# Altium schematic sheet GPS.SchDoc: Smart Bus Ticketing Machine/GPS
size A4; Date: 3/10/2025; ApprovedBy: Kiran Gunathilaka; CheckedBy: Kiran Gunathilaka; Author: Kiran Gunathilaka; DrawnBy: Kiran Gunathilaka; DocumentNumber: 04; Revision: v1.1; SheetNumber: 3; SheetTotal: 11
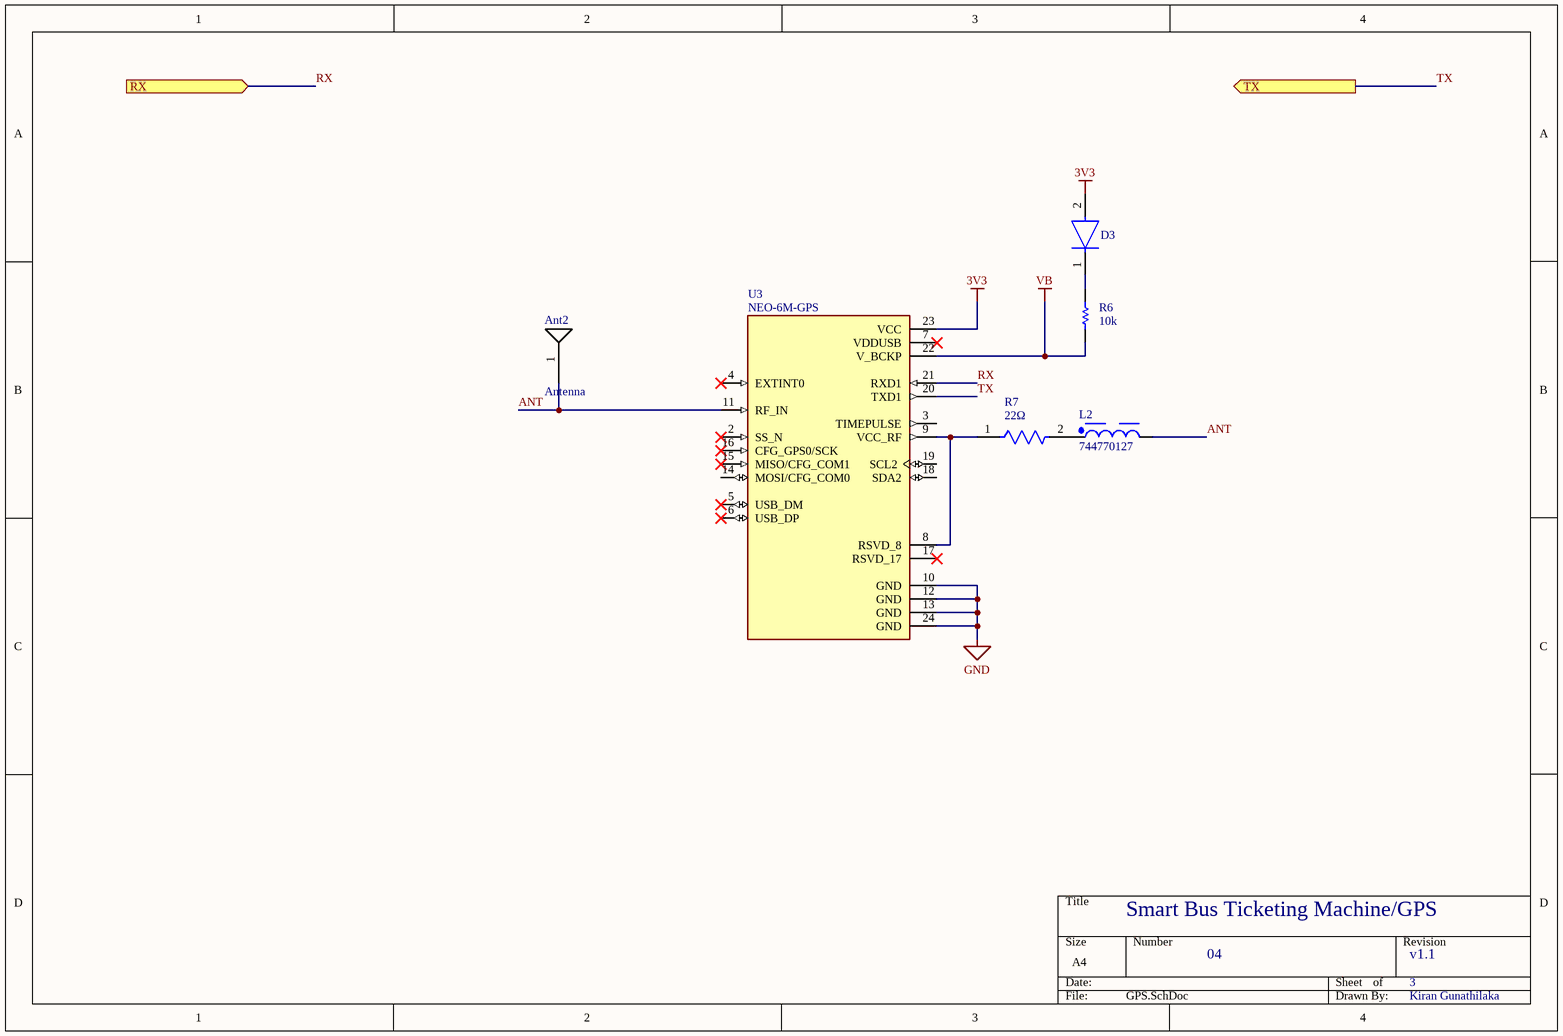
[diagram p0: GPS.SchDoc]

## Parts
Ant2  Antenna  [Antenna]
D3  TS4148 RYG  [FP-TS4148_RYG-MFG]  (value not drawn)
L2  744770127  [WE-PD_1280]
R6  value 10k  [RESC2013X60X35NL10T20]  (hidden comment: RC0805FR-0710KL)
R7  value 22Ω  [FP-CRGCQ0805-IPC_C]  (hidden comment: CRGCQ0805F22R)
U3  NEO-6M-GPS  [XCVR_NEO-6M-GPS]

## Ports
RX (in, see Main[2B]), TX (out, see Main[2B])

## Nets
3V3: D3.2(A) U3.23(VCC)
GND: U3.10(GND) U3.12(GND) U3.13(GND) U3.24(GND)
VB: R6.1 U3.22(V_BCKP)
ANT: Ant2.1 L2.2 U3.11(RF_IN)
RX: U3.21(RXD1) ; port RX
TX: U3.20(TXD1) ; port TX
NetD3_1: D3.1(C) R6.2
NetL2_1: L2.1 R7.2
NetR7_1: R7.1 U3.8(RSVD_8) U3.9(VCC_RF)

Not connected (* = marked no-connect by the designer): U3 2(SS_N)* 3(TIMEPULSE) 4(EXTINT0)* 5(USB_DM)* 6(USB_DP)* 7(VDDUSB)* 14(MOSI/CFG_COM0) 15(MISO/CFG_COM1)* 16(CFG_GPS0/SCK)* 17(RSVD_17)* 18(SDA2) 19(SCL2)

## Library data of the parts
D3 = CMP-15605-000006-1: Rectifier Diode Switching 75V 0.15A 4ns 2-Pin Case 0805(2012Metric) T/R; Peak Non-Repetitive Surge Current: 2A; Element Configuration: Single; Forward Voltage: 1V; Max Operating Temperature: 175°C; Packaging: Tape and Reel; Radiation Hardening: No; Min Operating Temperature: -65°C; Reverse Recovery Time: 4ns; Mount: Surface Mount; RoHS Compliant: Yes; Max Forward Surge Current (Ifsm): 2A; Case/Package: SMD/SMT; Number of Pins: 2; Max Repetitive Reverse Voltage (Vrrm): 75V
L2 = CMP-0227-00199-2: NexarPartId: 22866873; Resistance: 46mΩ; Test Frequency: 1kHz; DC Resistance (DCR): 31mΩ; Max DC Current: 3.7A; Shielding: Shielded; Self Resonant Frequency: 10MHz; Core Material: Ferrite; Current Rating: 4.2A; Inductance: 27µH; Tolerance: 20%; Saturation Current: 3.8A; Height - Seated (Max): 8.001mm; Series Resistance: 46mΩ; Packaging: Cut Tape (CT); Height: 8mm; Number of Pins: 2; Length: 12mm; Depth: 12mm; REACH SVHC: Unknown; Lead Free: Lead Free; Composition: Wirewound; Case/Package: Nonstandard; Lead Pitch: 7mm; Termination: SMD/SMT; Min Operating Temperature: -40°C; Ambient Temperature Range High: 85°C; Max Operating Temperature: 125°C; Ambient Temperature Range Low: -40°C; Width: 12mm; RoHS: Compliant; RMS Current (Irms): 3.7A; Mount: Surface Mount; Inductance Tolerance: 20%
R6 = CMP-1659-00013-4: Chip Resistor, 10 KOhm, +/- 1%, 0.125 W, -55 to 155 degC, 0805 (2012 Metric), RoHS, Tape and Reel; Manufacturer: Yageo; Voltage Rating: 150 V; Mount: Surface Mount; ComponentLink1Description: Manufacturer URL; ComponentLink2URL: http://www.yageo.com/documents/recent/PYu-RC_Group_51_RoHS_L_04.pdf; Pins: 2; Length: 2 mm; Min Operating Temperature: -55 degC; Height: 0.5 mm; Mounting Technology: Surface Mount; RoHSCompliant: true; REACH SVHC: No SVHC; ComponentLink1URL: http://www.yageo.com/; Max Operating Temperature: 155 degC; PackageReference: 0805; DatasheetVersion: Rev. 4, 02/2016; Package Quantity: 5000; Packaging: Tape and Reel; ComponentLink2Description: Datasheet; PackageDescription: 2-Pin Surface Mounted Device, Body 2 x 1.25 mm
R7 = CMP-03211-006853-1: CRGCQ 0805 22R 1%; Manufacturer: TE Connectivity; Voltage Rating: 150V; Tolerance: 0.01; Power Rating: 0.125W; Automotive Grade: Grade 301; Temperature Coefficient: ±200ppm/°C; Temperature: -55°C to +155°C; Digikey Description: CRGCQ 0805 22R 1%; Ipc Land Pattern Name: RESC200125X55; Temperature Range Low: -55°C; ComponentLink2URL: https://www.te.com/commerce/DocumentDelivery/DDEController?Action=showdoc&DocId=Data+Sheet%7F1773204-3%7F1%7Fpdf%7FEnglish%7FENG_DS_1773204-3_1.pdf%7F4-2176341-310; Package: CRGCQ0805; Octopart: https://octopart.com/crgcq0805f22r-te+connectivity-91018162; Height: 0.65mm; Ambient Temperature Range High: +70°C; Resistance: 22Ω; Manufacturer Part Number: CRGCQ0805F22R; Device Class L2: Resistors; Composition: Thick Film; Temperature Range High: +155°C; Device Class L3: Chip SMD Resistors; RoHS: TRUE; Lead Free: Yes; Mouser Description: SMD AEC-Q200 Compliant Thick Film Chip Resistor; Device Class L1: Passive Components; ComponentLink2Description: Datasheet; Series: CRGCQ; Category: Res; Automotive: Yes
U3 = NEO-6M-GPS: GPS Development Tools SparkFun GNSS-RTK Dead Reckoning Breakout - ZED-F9K (Qwiic); MF: u-blox; SnapEDA_Link: https://www.snapeda.com/parts/NEO-6M-GPS/u-blox/view-part/?ref=snap; MP: NEO-6M-GPS; Availability: Not in stock; Price: None; Check_prices: https://www.snapeda.com/parts/NEO-6M-GPS/u-blox/view-part/?ref=eda; Value: *; Package: None